# EAGLE design mouse_shield (EAGLE 5.11)
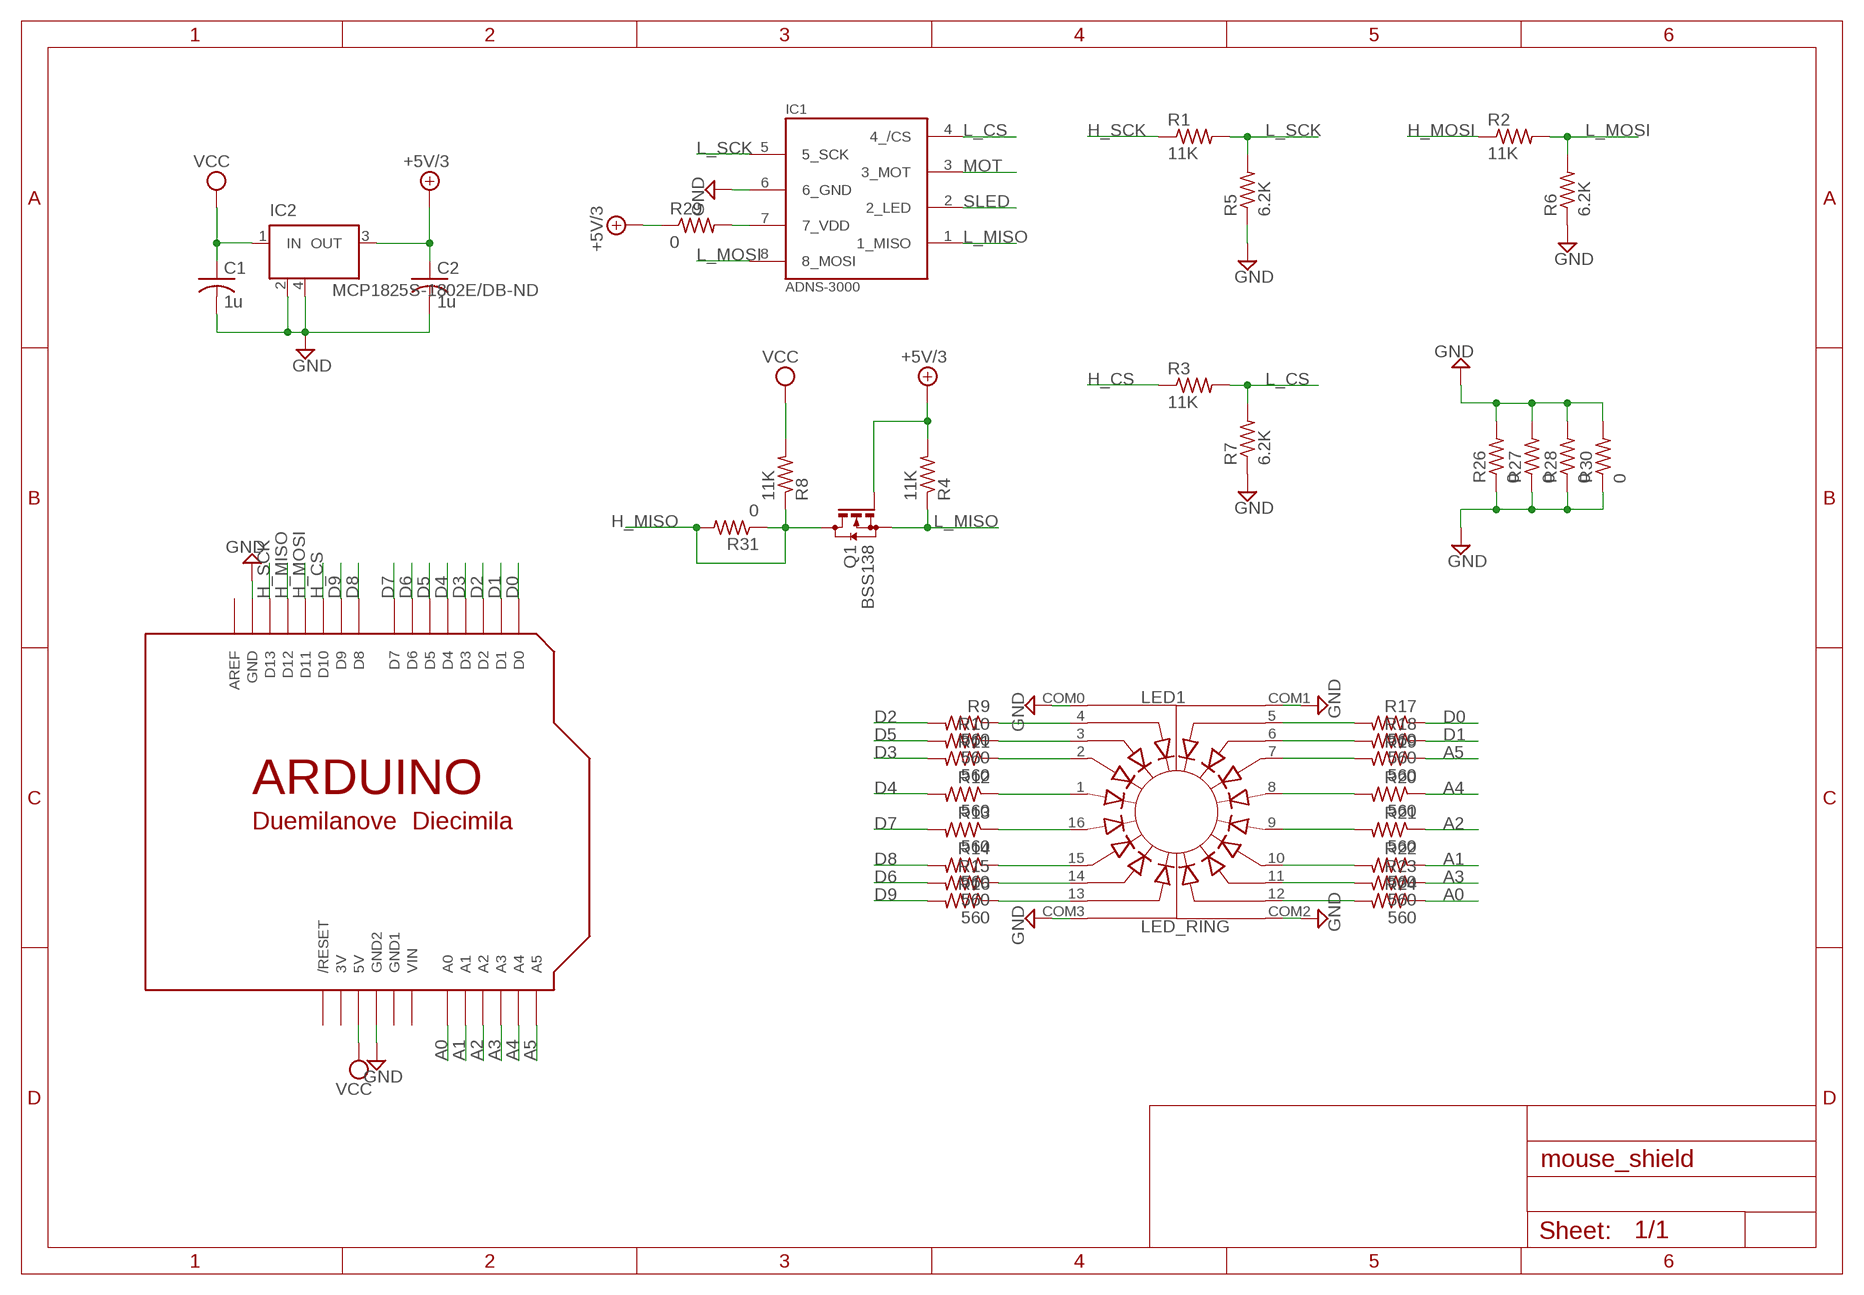
[diagram p0: schematic, sheet 1]

## Parts
C1  1u  C-USC1206  [C1206]
C2  1u  C-USC1206  [C1206]
IC1  ADNS-3000  [ADNS-3000]
IC2  MCP1825S-1802E/DB-ND  LM340S  [SOT223]
LED1  LED_RING  [LED_RING]
Q1  BSS138  BSS123  [SOT23]
R1  11K  R-US_R1206  [R1206]
R2  11K  R-US_R1206  [R1206]
R3  11K  R-US_R1206  [R1206]
R4  11K  R-US_R1206  [R1206]
R5  6.2K  R-US_R1206  [R1206]
R6  6.2K  R-US_R1206  [R1206]
R7  6.2K  R-US_R1206  [R1206]
R8  11K  R-US_R1206  [R1206]
R9  560  R-US_R1206  [R1206]
R10  560  R-US_R1206  [R1206]
R11  560  R-US_R1206  [R1206]
R12  560  R-US_R1206  [R1206]
R13  560  R-US_R1206  [R1206]
R14  560  R-US_R1206  [R1206]
R15  560  R-US_R1206  [R1206]
R16  560  R-US_R1206  [R1206]
R17  560  R-US_R1206  [R1206]
R18  560  R-US_R1206  [R1206]
R19  560  R-US_R1206  [R1206]
R20  560  R-US_R1206  [R1206]
R21  560  R-US_R1206  [R1206]
R22  560  R-US_R1206  [R1206]
R23  560  R-US_R1206  [R1206]
R24  560  R-US_R1206  [R1206]
R26  0  R-US_R1206  [R1206]
R27  0  R-US_R1206  [R1206]
R28  0  R-US_R1206  [R1206]
R29  0  R-US_R1206  [R1206]
R30  0  R-US_R1206  [R1206]
R31  0  R-US_R1206  [R1206]
U$1  ARDUINO-NOHOLE  [ARDUINO-NOHOLE]

## Nets
+5V/3: C2.1 IC2.3(OUT) Q1.1(G) R4.2 R29.1
A0: R24.1 U$1.A0
A1: R22.1 U$1.A1
A2: R21.1 U$1.A2
A3: R23.1 U$1.A3
A4: R20.1 U$1.A4
A5: R19.1 U$1.A5
D0: R17.1 U$1.D0
D1: R18.1 U$1.D1
D2: R9.2 U$1.D2
D3: R11.2 U$1.D3
D4: R12.2 U$1.D4
D5: R10.2 U$1.D5
D6: R15.2 U$1.D6
D7: R13.2 U$1.D7
D8: R14.2 U$1.D8
D9: R16.2 U$1.D9
GND: C1.2 C2.2 IC1.6(6_GND) IC2.2(GND) IC2.4(GND) LED1.COM0 LED1.COM1 LED1.COM2 LED1.COM3 R5.1 R6.1 R7.1 R26.1 R26.2 R27.1 R27.2 R28.1 R28.2 R30.1 R30.2 U$1.GND U$1.GND2
H_CS: R3.1 U$1.D10
H_MISO: Q1.3(D) R8.1 R31.1 R31.2 U$1.D12
H_MOSI: R2.1 U$1.D11
H_SCK: R1.1 U$1.D13
L_CS: IC1.4(4_/CS) R3.2 R7.2
L_MISO: IC1.1(1_MISO) Q1.2(S) R4.1
L_MOSI: IC1.8(8_MOSI) R2.2 R6.2
L_SCK: IC1.5(5_SCK) R1.2 R5.2
MOT: IC1.3(3_MOT)
N$1: LED1.4 R9.1
N$2: LED1.3 R10.1
N$3: LED1.2 R11.1
N$4: LED1.1 R12.1
N$5: LED1.16 R13.1
N$6: LED1.15 R14.1
N$7: LED1.14 R15.1
N$8: LED1.13 R16.1
N$9: LED1.5 R17.2
N$10: LED1.6 R18.2
N$11: LED1.7 R19.2
N$12: LED1.8 R20.2
N$13: LED1.9 R21.2
N$14: LED1.10 R22.2
N$15: LED1.11 R23.2
N$16: LED1.12 R24.2
N$17: IC1.7(7_VDD) R29.2
SLED: IC1.2(2_LED)
VCC: C1.1 IC2.1(IN) R8.2 U$1.5V
Unconnected: U$1.AREF U$1.RESET(/RESET)

## Power pins joined to a net without a drawn wire
3V: U$1.3V
GND1: U$1.GND1
VIN: U$1.VIN

## Library data of the parts
C1 C2 = rcl:C-US: CAPACITOR, American symbol
IC1 = avago:ADNS-3000
IC2 = linear:LM340S: 3-Terminal Positive Regulators Source: http://cache.national.com/ds/LM/LM340.pdf
LED1 = SparkFun:LED_RING: 16 LED Ring http://dlnmh9ip6v2uc.cloudfront.net/datasheets/Components/LED/Top-Up%20LED%20Ring%20LED-CCL-A.pdf
Q1 = transistor-small-signal:BSS123: N-CHANNEL MOS FET
R1-R24 R26-R31 = rcl:R-US_: RESISTOR, American symbol
U$1 = adafruit:ARDUINO: Arduino Diecimila/Duemilanove Make a shield with ease, this package has all the named pins as well as the two mounting drill holes and an outline of the USB and DC power connector. The outline is on the DIMENSION layer, so if your board house uses it they will cut the outline to match. http://www.ladyada.net/library/pcb/eaglelibrary.html

## Board
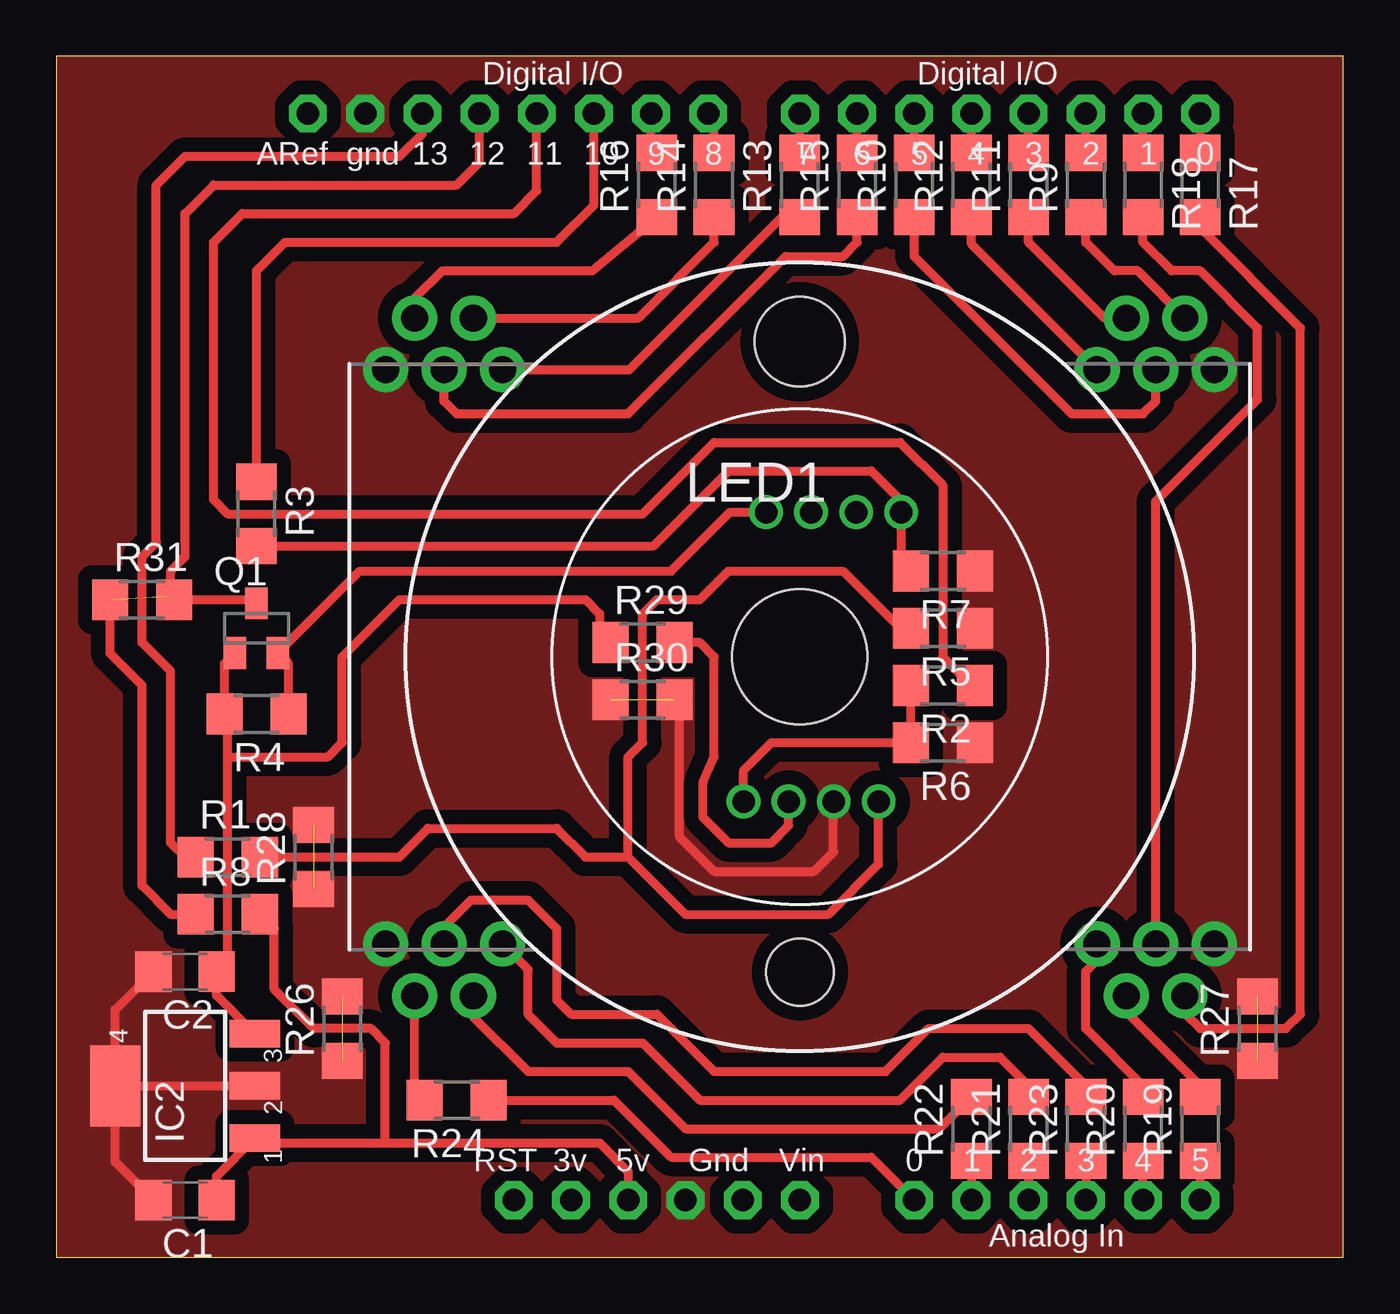
[diagram p1: board, top side]
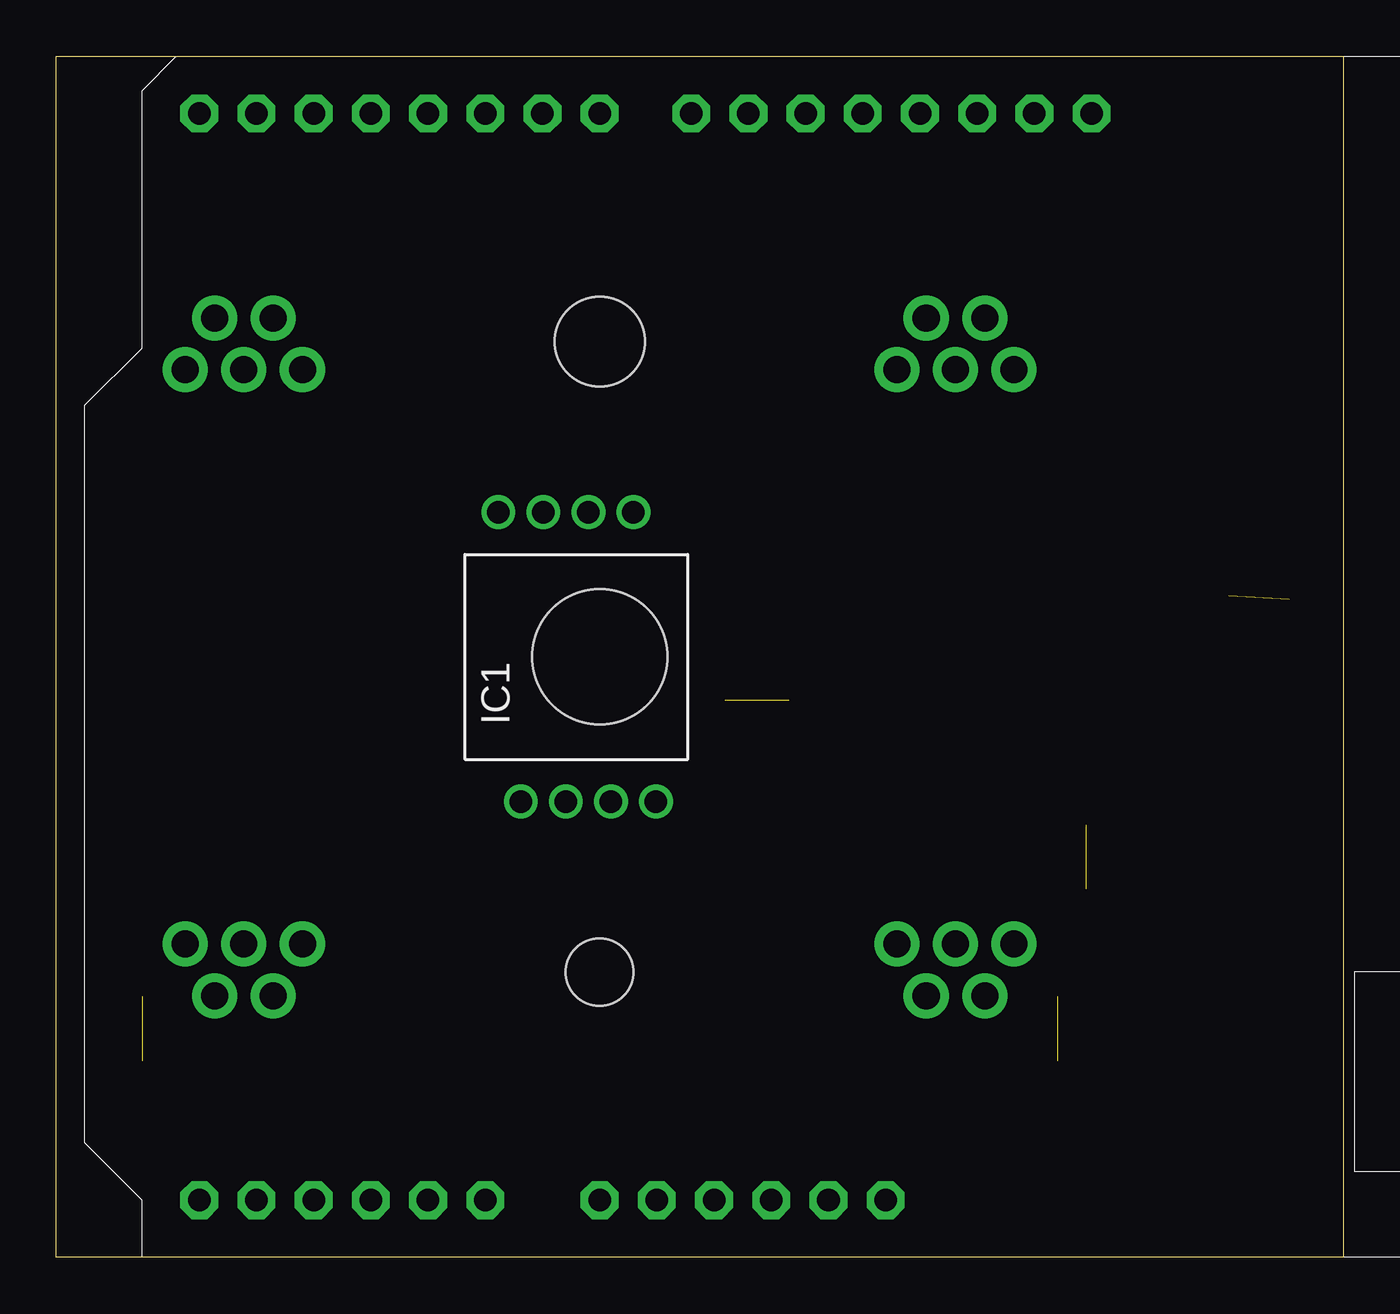
[diagram p2: board, bottom side, seen from below]

Size 57.15 x 53.34 mm. Coordinates in mm from the lower left corner, seen from the top.
Outline: 0,0 57.15,0 57.15,53.34 0,53.34 0,0
Copper layers (1*16): Top 0.035mm / dielectric 1.5mm / Bottom 0.035mm
Design rules "fab *": minimum track width 12mil, minimum drill 1mm, track to track 15.5mil, track to pad 15.5mil, pad to pad 15mil, via to via 15mil, smd to smd 10mil, copper to edge 0mil, drill to drill 1mm, minimum pad ring 0.2mm, minimum via ring 0.2mm, stop-mask expansion 4mil, vias tented up to drill 0mil, thermal gap 1mm

### Footprints (pad centres in the part's own frame; a part is rotated, then mirrored left to right if it is on the bottom)
C1206 = smd 1.6 x 1.8: 1 -1.4,0; 2 1.4,0
ADNS-3000 = drill 1 round: 1 1.5,6.425; 2 -0.5,6.425; 3 -2.5,6.425; 4 -4.5,6.425; 5 -3.5,-6.425; 6 -1.5,-6.425; 7 0.5,-6.425; 8 2.5,-6.425 | hole 6: 0,0
SOT223 = smd 1.219 x 2.235: 1 -2.311,-3.099; 2 0,-3.099; 3 2.311,-3.099 | smd 3.6 x 2.2: 4 0,3.099
LED_RING = drill 1.2 pad 2 round: 1 13.2,12.75; 2 14.5,15.05; 3 15.8,12.75; 4 17.1,15.05; 5 17.1,-15.05; 6 15.8,-12.75; 7 14.5,-15.05; 8 13.2,-12.75; 9 -13.2,-12.75; 10 -14.5,-15.05; 11 -15.8,-12.75; 12 -17.1,-15.05; 13 -17.1,15.05; 14 -15.8,12.75; 15 -14.5,15.05; 16 -13.2,12.75; COM0 18.4,12.75; COM1 18.4,-12.75; COM2 -18.4,-12.75; COM3 -18.4,12.75 | hole 4: 0,14 | hole 3: 0,-14
SOT23 = smd 1 x 1.4: 1 -0.95,-1.1; 2 0.95,-1.1; 3 0,1.1
R1206 = smd 1.6 x 1.803: 1 -1.422,0; 2 1.422,0
ARDUINO-NOHOLE = drill 1 pad 1.676 octagon: 3V 35.56,2.54; 5V 38.1,2.54; A0 50.8,2.54; A1 53.34,2.54; A2 55.88,2.54; A3 58.42,2.54; A4 60.96,2.54; A5 63.5,2.54; AREF 23.876,50.8; D0 63.5,50.8; D1 60.96,50.8; D2 58.42,50.8; D3 55.88,50.8; D4 53.34,50.8; D5 50.8,50.8; D6 48.26,50.8; D7 45.72,50.8; D8 41.656,50.8; D9 39.116,50.8; D10 36.576,50.8; D11 34.036,50.8; D12 31.496,50.8; D13 28.956,50.8; GND 26.416,50.8; GND1 43.18,2.54; GND2 40.64,2.54; RESET 33.02,2.54; VIN 45.72,2.54

### Placement (x,y rotation side)
C1  5.71,2.54 180 top
C2  5.71,12.7 180 top
IC1  33.02,26.67 0 bottom
IC2  5.71,7.62 90 top
LED1  33.02,26.67 0 top
Q1  8.89,27.94 0 top
R1  7.62,17.78 0 top
R2  39.37,25.4 180 top
R3  8.89,33.02 270 top
R4  8.89,24.13 180 top
R5  39.37,27.94 180 top
R6  39.37,22.86 180 top
R7  39.37,30.48 180 top
R8  7.62,15.24 0 top
R9  45.72,47.62 90 top
R10  38.1,47.62 90 top
R11  43.18,47.62 90 top
R12  40.64,47.62 90 top
R13  33.02,47.62 90 top
R14  29.21,47.62 90 top
R15  35.56,47.62 90 top
R16  26.67,47.62 90 top
R17  50.8,47.62 270 top
R18  48.26,47.62 270 top
R19  50.8,5.71 90 top
R20  48.26,5.71 90 top
R21  43.18,5.71 90 top
R22  40.64,5.71 90 top
R23  45.72,5.71 90 top
R24  17.78,6.99 180 top
R26  12.7,10.16 90 top
R27  53.34,10.16 90 top
R28  11.43,17.78 90 top
R29  26.04,27.3 0 top
R30  26.04,24.77 0 top
R31  3.81,29.21 0 top
U$1  -12.7,0 0 top

### Tracks (layer width: path | path; a pad name or v marks a point on that pad's centre or on a via)
+5V/3
  Top 0.406: Q1.1 7.47,26.37 R4.2 | C2.1 7.12,11.63 IC2.3 | C2.1 6.98,12.83 6.86,12.83 | R4.2 7.62,24.13 | R4.2 7.62,23.98 7.62,22.23 | 7.62,22.23 7.62,13.21 C2.1 | 7.62,22.23 12.07,22.23 12.7,22.86 12.7,26.67 15.24,29.21 23.5,29.21 24.13,28.57 24.13,27.79 R29.1
A0
  Top 0.406: R24.1 24.77,6.99 27.31,4.45 36.2,4.45 U$1.A0
A1
  Top 0.406: R22.1 U$1.A1
A2
  Top 0.406: R21.1 U$1.A2
A3
  Top 0.406: R23.1 U$1.A3
A4
  Top 0.406: U$1.A4 R20.1
A5
  Top 0.406: U$1.A5 R19.1
D0
  Top 0.406: R17.1 U$1.D0
D1
  Top 0.406: R18.1 U$1.D1
D2
  Top 0.406: R9.2 U$1.D2
D3
  Top 0.406: R11.2 U$1.D3
D4
  Top 0.406: R12.2 U$1.D4
D5
  Top 0.406: R10.2 U$1.D5
D6
  Top 0.406: R15.2 U$1.D6
D7
  Top 0.406: R13.2 U$1.D7
D8
  Top 0.406: R14.2 29.21,50.55 U$1.D8
D9
  Top 0.406: U$1.D9 26.42,48.83 R16.2
GND  (4 unrouted)
  Top 0.406: IC2.4 IC2.2 | IC2.4 2.62,11 C2.2 | IC2.4 2.62,4.24 C1.2 | IC1.6 34.52,18.01 33.66,17.14 29.21,17.14 27.69,18.67 27.69,24.54 R30.2
  pour Top (isolate 0.635, no thermals): 0,53.34 57.15,53.34 57.15,0 0,0
H_CS
  Top 0.406: U$1.D10 23.88,46.74 22.22,45.09 10.16,45.09 8.89,43.81 R3.1
H_MISO  (1 unrouted)
  Top 0.406: U$1.D12 18.8,48.64 17.78,47.62 6.98,47.62 5.71,46.35 5.71,31.11 5.08,30.48 5.08,29.36 R31.2 8.72,29.21 Q1.3 | R8.1 5.08,15.24 3.81,16.51 3.81,25.4 2.39,26.82 R31.1
H_MOSI
  Top 0.406: U$1.D11 21.34,47.37 20.32,46.35 8.25,46.35 6.98,45.09 6.98,33.66 7.62,33.02 26.04,33.02 29.21,36.2 37.47,36.2 39.37,34.29 39.37,26.67 40.64,25.4 R2.1
H_SCK
  Top 0.406: U$1.D13 16.26,49.91 15.24,48.9 5.71,48.9 4.45,47.62 4.45,31.75 3.81,31.11 3.81,27.3 5.08,26.04 5.08,18.41 5.71,17.78 R1.1
L_CS
  Top 0.406: IC1.4 37.52,30.91 arc90 R7.2 | IC1.4 37.47,33.15 | IC1.4 37.52,33.6 36.2,34.92 29.85,34.92 26.52,31.6 R3.2
L_MISO
  Top 0.406: R4.1 10.31,26.37 Q1.2 | IC1.1 29.92,33.09 27.31,30.48 13.48,30.48 Q1.2 | Q1.2 10.01,26.67
L_MOSI
  Top 0.406: IC1.8 30.52,21.63 31.75,22.86 R6.2 R2.2
L_SCK
  Top 0.406: IC1.5 36.52,17.47 34.29,15.24 27.94,15.24 25.4,17.78 | R1.2 15.24,17.78 16.51,19.05 22.22,19.05 23.5,17.78 25.4,17.78 | R5.2 37.47,27.94 34.92,30.48 29.85,30.48 28.57,29.21 26.67,29.21 26.04,28.57 26.04,22.86 25.4,22.23 25.4,17.78
N$1
  Top 0.406: 45.72,46.12 R9.1 45.72,45.09 46.99,43.81 48.03,43.81 LED1.4
N$2
  Top 0.406: LED1.3 48.82,38.02 48.26,37.47 45.08,37.47 38.1,44.45 R10.1
N$3
  Top 0.406: LED1.2 46.55,41.72 43.18,45.09 R11.1
N$4
  Top 0.406: LED1.1 40.64,45 R12.1
N$5
  Top 0.406: LED1.16 25.45,39.42 32.23,46.2 R13.1
N$6
  Top 0.406: LED1.15 25.85,41.72 29.21,45.09 R14.1
N$7
  Top 0.406: LED1.14 17.22,38.02 17.78,37.47 25.4,37.47 32.39,44.45 34.92,44.45 35.56,45.09 R15.1
N$8
  Top 0.406: LED1.13 15.92,42.59 17.14,43.81 23.81,43.81 R16.1
N$9
  Top 0.406: LED1.5 50.17,11.57 50.17,10.79 50.8,10.16 54.61,10.16 55.24,10.79 55.24,41.27 50.8,45.72 R17.2
N$10
  Top 0.406: 48.26,46.35 R18.2 48.26,45.09 49.53,43.81 50.8,43.81 53.34,41.27 53.34,38.1 48.82,33.58 LED1.6
N$11
  Top 0.406: LED1.7 47.52,10.9 50.8,7.62 R19.2
N$12
  Top 0.406: LED1.8 46.22,13.2 45.72,12.7 45.72,10.16 48.26,7.62 R20.2
N$13
  Top 0.406: R21.2 43.18,7.62 41.91,8.89 39.37,8.89 37.47,6.99 28.57,6.99 26.04,9.53 22.22,9.53 20.96,10.79 20.96,12.79 LED1.9
N$14
  Top 0.406: LED1.10 18.52,10.69 20.96,8.26 25.4,8.26 27.94,5.71 39.22,5.71 R22.2
N$15
  Top 0.406: 45.72,6.99 R23.2 45.72,7.62 43.18,10.16 38.73,10.16 36.83,8.26 29.21,8.26 26.67,10.79 22.86,10.79 22.22,11.43 22.22,14.61 20.96,15.88 18.41,15.88 17.14,14.61 17.14,13.99 LED1.11
N$16
  Top 0.406: LED1.12 15.92,7.42 R24.2
N$17
  Top 0.406: IC1.7 32.52,19.18 31.75,18.41 29.85,18.41 28.73,19.53 28.73,21.11 29.21,22.23 29.21,26.67 28.57,27.3 R29.2
VCC
  Top 0.406: C1.1 7.12,3.61 IC2.1 9.04,5.08 14.61,5.08 | U$1.5V 25.4,3.81 24.13,5.08 14.61,5.08 | R8.2 9.68,14.61 9.68,11.91 11.43,10.16 13.97,10.16 14.61,9.53 14.61,5.08